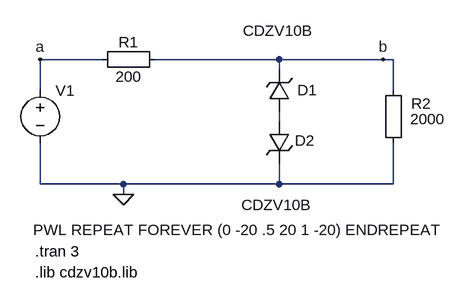
[diagram p0: schematic VL-P-B1.asc]
VL-P-B1.asc, the LTspice schematic file:
Version 4
SHEET 1 880 680
WIRE -96 112 -192 112
WIRE 176 112 -16 112
WIRE 336 112 176 112
WIRE 352 112 336 112
WIRE 176 128 176 112
WIRE -192 160 -192 112
WIRE 352 160 352 112
WIRE 176 208 176 192
WIRE -192 304 -192 240
WIRE -64 304 -192 304
WIRE 176 304 176 272
WIRE 176 304 -64 304
WIRE 352 304 352 240
WIRE 352 304 176 304
WIRE -64 320 -64 304
FLAG -192 112 a
FLAG 336 112 b
FLAG -64 320 0
SYMBOL Misc\\EuropeanResistor 0 96 R90
WINDOW 0 5 56 VBottom 2
WINDOW 3 27 56 VTop 2
SYMATTR InstName R1
SYMATTR Value 200
SYMBOL zener 192 192 R180
WINDOW 0 -43 33 Left 2
WINDOW 3 -36 124 Left 2
SYMATTR InstName D1
SYMATTR Value CDZV10B
SYMATTR Description Diode
SYMATTR Type diode
SYMBOL Misc\\EuropeanResistor 368 256 R180
WINDOW 0 -42 76 Left 2
WINDOW 3 -64 52 Left 2
SYMATTR InstName R2
SYMATTR Value 2000
SYMBOL voltage -192 144 R0
WINDOW 3 -11 231 Left 2
WINDOW 123 0 0 Left 2
WINDOW 39 0 0 Left 2
SYMATTR Value PWL REPEAT FOREVER (0 -20 .5 20 1 -20) ENDREPEAT
SYMATTR InstName V1
SYMBOL zener 160 208 R0
WINDOW 0 40 29 Left 2
WINDOW 3 -42 128 Left 2
SYMATTR InstName D2
SYMATTR Value CDZV10B
SYMATTR Description Diode
SYMATTR Type diode
TEXT -200 408 Left 2 !.tran 3
TEXT -200 440 Left 2 !.lib cdzv10b.lib

The netlist it stands for:
* VL-P-B1.asc
R1 b a 200
D1 N001 b CDZV10B
R2 0 b 2000
V1 a 0 PWL REPEAT FOREVER (0 -20 .5 20 1 -20) ENDREPEAT
D2 N001 0 CDZV10B
.model D D
.lib standard.dio
.tran 3
.lib cdzv10b.lib
.backanno
.end